# Altium schematic sheet EEG_2.SchDoc
size A3
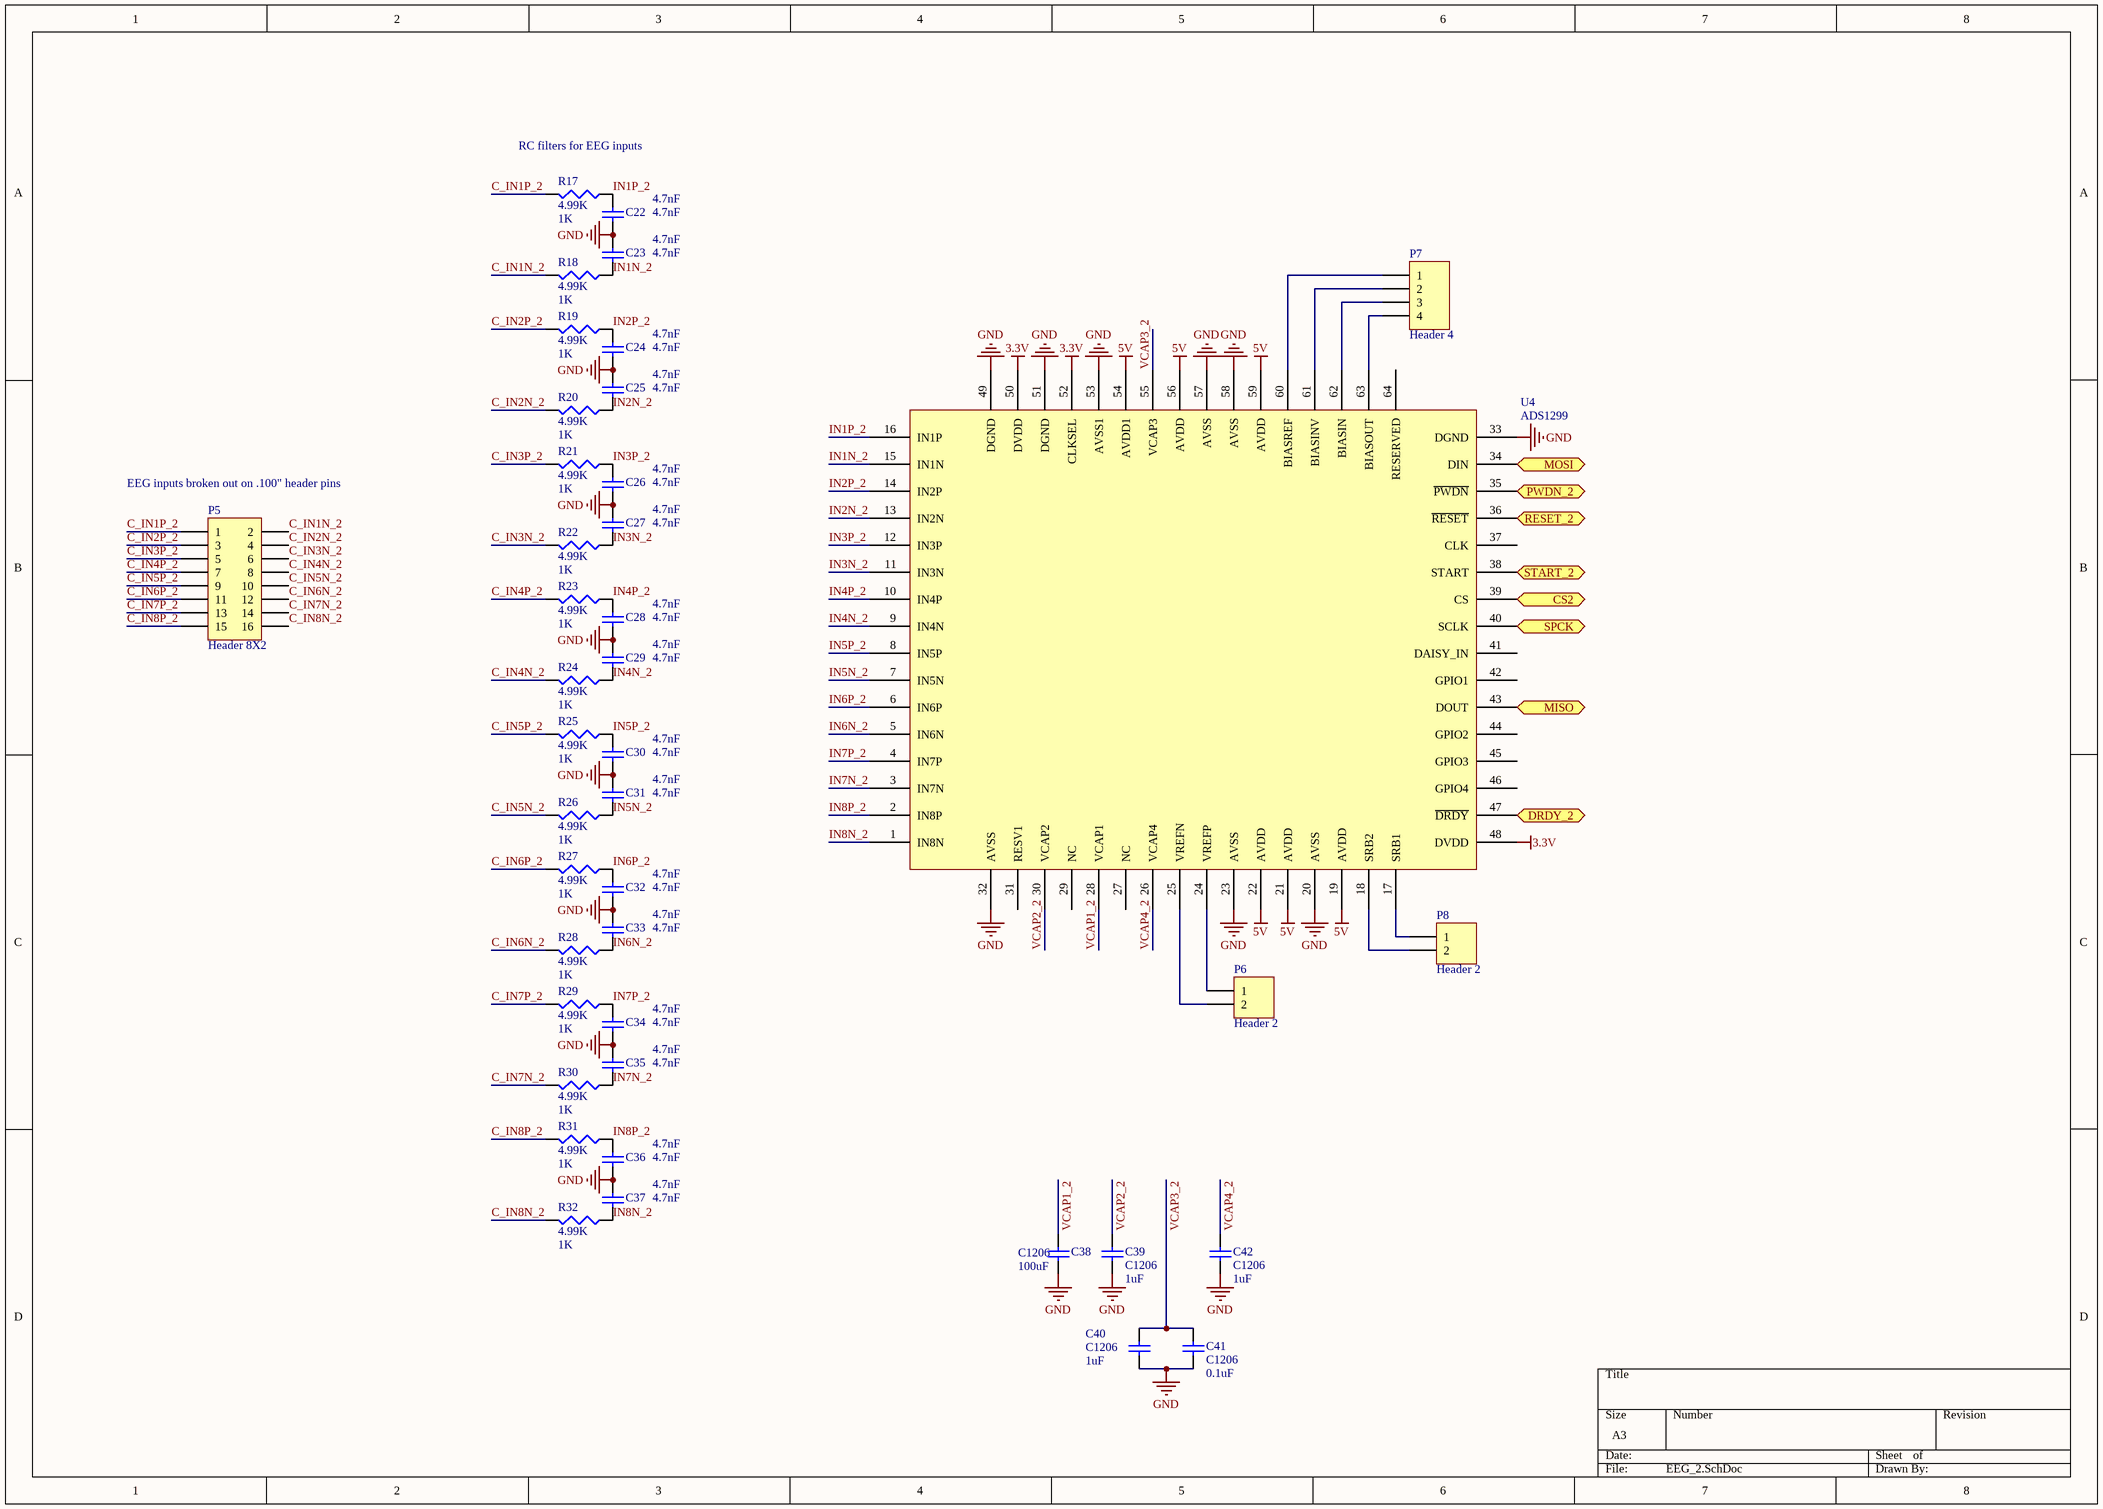
[diagram p0: EEG_2.SchDoc]

## Parts
C22  4.7nF  [1608[0603]]
C23  4.7nF  [1608[0603]]
C24  4.7nF  [1608[0603]]
C25  4.7nF  [1608[0603]]
C26  4.7nF  [1608[0603]]
C27  4.7nF  [1608[0603]]
C28  4.7nF  [1608[0603]]
C29  4.7nF  [1608[0603]]
C30  4.7nF  [1608[0603]]
C31  4.7nF  [1608[0603]]
C32  4.7nF  [1608[0603]]
C33  4.7nF  [1608[0603]]
C34  4.7nF  [1608[0603]]
C35  4.7nF  [1608[0603]]
C36  4.7nF  [1608[0603]]
C37  4.7nF  [1608[0603]]
C38  C1206  value 100uF  [1608[0603]]
C39  C1206  value 1uF  [1608[0603]]
C40  C1206  value 1uF  [1608[0603]]
C41  C1206  value 0.1uF  [1608[0603]]
C42  C1206  value 1uF  [1608[0603]]
P5  Header 8X2  [HDR2X8]
P6  Header 2  [HDR1X2]
P7  Header 4  [HDR1X4]
P8  Header 2  [HDR1X2]
R17  4.99K  value 1K  [1608[0603]]
R18  4.99K  value 1K  [1608[0603]]
R19  4.99K  value 1K  [1608[0603]]
R20  4.99K  value 1K  [1608[0603]]
R21  4.99K  value 1K  [1608[0603]]
R22  4.99K  value 1K  [1608[0603]]
R23  4.99K  value 1K  [1608[0603]]
R24  4.99K  value 1K  [1608[0603]]
R25  4.99K  value 1K  [1608[0603]]
R26  4.99K  value 1K  [1608[0603]]
R27  4.99K  value 1K  [1608[0603]]
R28  4.99K  value 1K  [1608[0603]]
R29  4.99K  value 1K  [1608[0603]]
R30  4.99K  value 1K  [1608[0603]]
R31  4.99K  value 1K  [1608[0603]]
R32  4.99K  value 1K  [1608[0603]]
U4  ADS1299  [ADS1299 Plastic QFP]

## Ports
CS2, DRDY_2, MISO, MOSI, PWDN_2, RESET_2, SPCK, START_2

## Nets
3.3V: U4.48(DVDD) U4.50(DVDD) U4.52(CLKSEL)
5V: U4.19(AVDD) U4.21(AVDD) U4.22(AVDD) U4.54(AVDD1) U4.56(AVDD) U4.59(AVDD)
GND: C22.1 C23.2 C24.1 C25.2 C26.1 C27.2 C28.1 C29.2 C30.1 C31.2 C32.1 C33.2 C34.1 C35.2 C36.1 C37.2 C38.2 C39.1 C40.2 C41.1 C42.1 U4.20(AVSS) U4.23(AVSS) U4.32(AVSS) U4.33(DGND) U4.49(DGND) U4.51(DGND) U4.53(AVSS1) U4.57(AVSS) U4.58(AVSS)
C_IN1N_2: P5.2 R18.2
C_IN1P_2: P5.1 R17.2
C_IN2N_2: P5.4 R20.2
C_IN2P_2: P5.3 R19.2
C_IN3N_2: P5.6 R22.2
C_IN3P_2: P5.5 R21.2
C_IN4N_2: P5.8 R24.2
C_IN4P_2: P5.7 R23.2
C_IN5N_2: P5.10 R26.2
C_IN5P_2: P5.9 R25.2
C_IN6N_2: P5.12 R28.2
C_IN6P_2: P5.11 R27.2
C_IN7N_2: P5.14 R30.2
C_IN7P_2: P5.13 R29.2
C_IN8N_2: P5.16 R32.2
C_IN8P_2: P5.15 R31.2
CS2: U4.39(CS) ; port CS2
DRDY_2: U4.47(~{DRDY}) ; port DRDY_2
IN1N_2: C23.1 R18.1 U4.15(IN1N)
IN1P_2: C22.2 R17.1 U4.16(IN1P)
IN2N_2: C25.1 R20.1 U4.13(IN2N)
IN2P_2: C24.2 R19.1 U4.14(IN2P)
IN3N_2: C27.1 R22.1 U4.11(IN3N)
IN3P_2: C26.2 R21.1 U4.12(IN3P)
IN4N_2: C29.1 R24.1 U4.9(IN4N)
IN4P_2: C28.2 R23.1 U4.10(IN4P)
IN5N_2: C31.1 R26.1 U4.7(IN5N)
IN5P_2: C30.2 R25.1 U4.8(IN5P)
IN6N_2: C33.1 R28.1 U4.5(IN6N)
IN6P_2: C32.2 R27.1 U4.6(IN6P)
IN7N_2: C35.1 R30.1 U4.3(IN7N)
IN7P_2: C34.2 R29.1 U4.4(IN7P)
IN8N_2: C37.1 R32.1 U4.1(IN8N)
IN8P_2: C36.2 R31.1 U4.2(IN8P)
MISO: U4.43(DOUT) ; port MISO
MOSI: U4.34(DIN) ; port MOSI
PWDN_2: U4.35(~{PWDN}) ; port PWDN_2
RESET_2: U4.36(~{RESET}) ; port RESET_2
SPCK: U4.40(SCLK) ; port SPCK
START_2: U4.38(START) ; port START_2
VCAP1_2: C38.1 U4.28(VCAP1)
VCAP2_2: C39.2 U4.30(VCAP2)
VCAP3_2: C40.1 C41.2 U4.55(VCAP3)
VCAP4_2: C42.2 U4.26(VCAP4)
NetP6_1: P6.1 U4.24(VREFP)
NetP6_2: P6.2 U4.25(VREFN)
NetP7_1: P7.1 U4.60(BIASREF)
NetP7_2: P7.2 U4.61(BIASINV)
NetP7_3: P7.3 U4.62(BIASIN)
NetP7_4: P7.4 U4.63(BIASOUT)
NetP8_1: P8.1 U4.17(SRB1)
NetP8_2: P8.2 U4.18(SRB2)

Not connected (* = marked no-connect by the designer): U4 27(NC) 29(NC) 31(RESV1) 37(CLK) 41(DAISY_IN) 42(GPIO1) 44(GPIO2) 45(GPIO3) 46(GPIO4) 64(RESERVED)

## Notes on the sheet
- RC filters for EEG inputs
- (near P5) EEG inputs broken out on .100" header pins

## Library data of the parts
C22-C42 = Cap Semi: Capacitor (Semiconductor SIM Model); Published: 8-Jun-2000; LatestRevisionDate: 29-May-2009; LatestRevisionNote: IPC-7351 Footprint Added.; PackageReference: C1206; Publisher: Altium Limited; PackageDescription: Chip Capacitor
  C22-C37: Value: 4.7nF
P5 = Header 8X2: Header, 8-Pin, Dual row; LatestRevisionDate: 17-Jul-2002; LatestRevisionNote: Re-released for DXP Platform.; Publisher: Altium Limited
P6 P8 = Header 2: Header, 2-Pin; LatestRevisionDate: 17-Jul-2002; LatestRevisionNote: Re-released for DXP Platform.; Publisher: Altium Limited
P7 = Header 4: Header, 4-Pin; LatestRevisionDate: 17-Jul-2002; LatestRevisionNote: Re-released for DXP Platform.; Publisher: Altium Limited
R17-R32 = Res3: Resistor; Published: 8-Jun-2000; LatestRevisionDate: 29-May-2009; LatestRevisionNote: IPC-7351 Footprint Added.; PackageReference: J1-0603; Publisher: Altium Limited; PackageDescription: Chip Resistor